# Altium schematic sheet JadePlus_v0.3.1_schematics_PG3_CONN.SchDoc
size A3; SheetNumber: 3; SheetTotal: 3
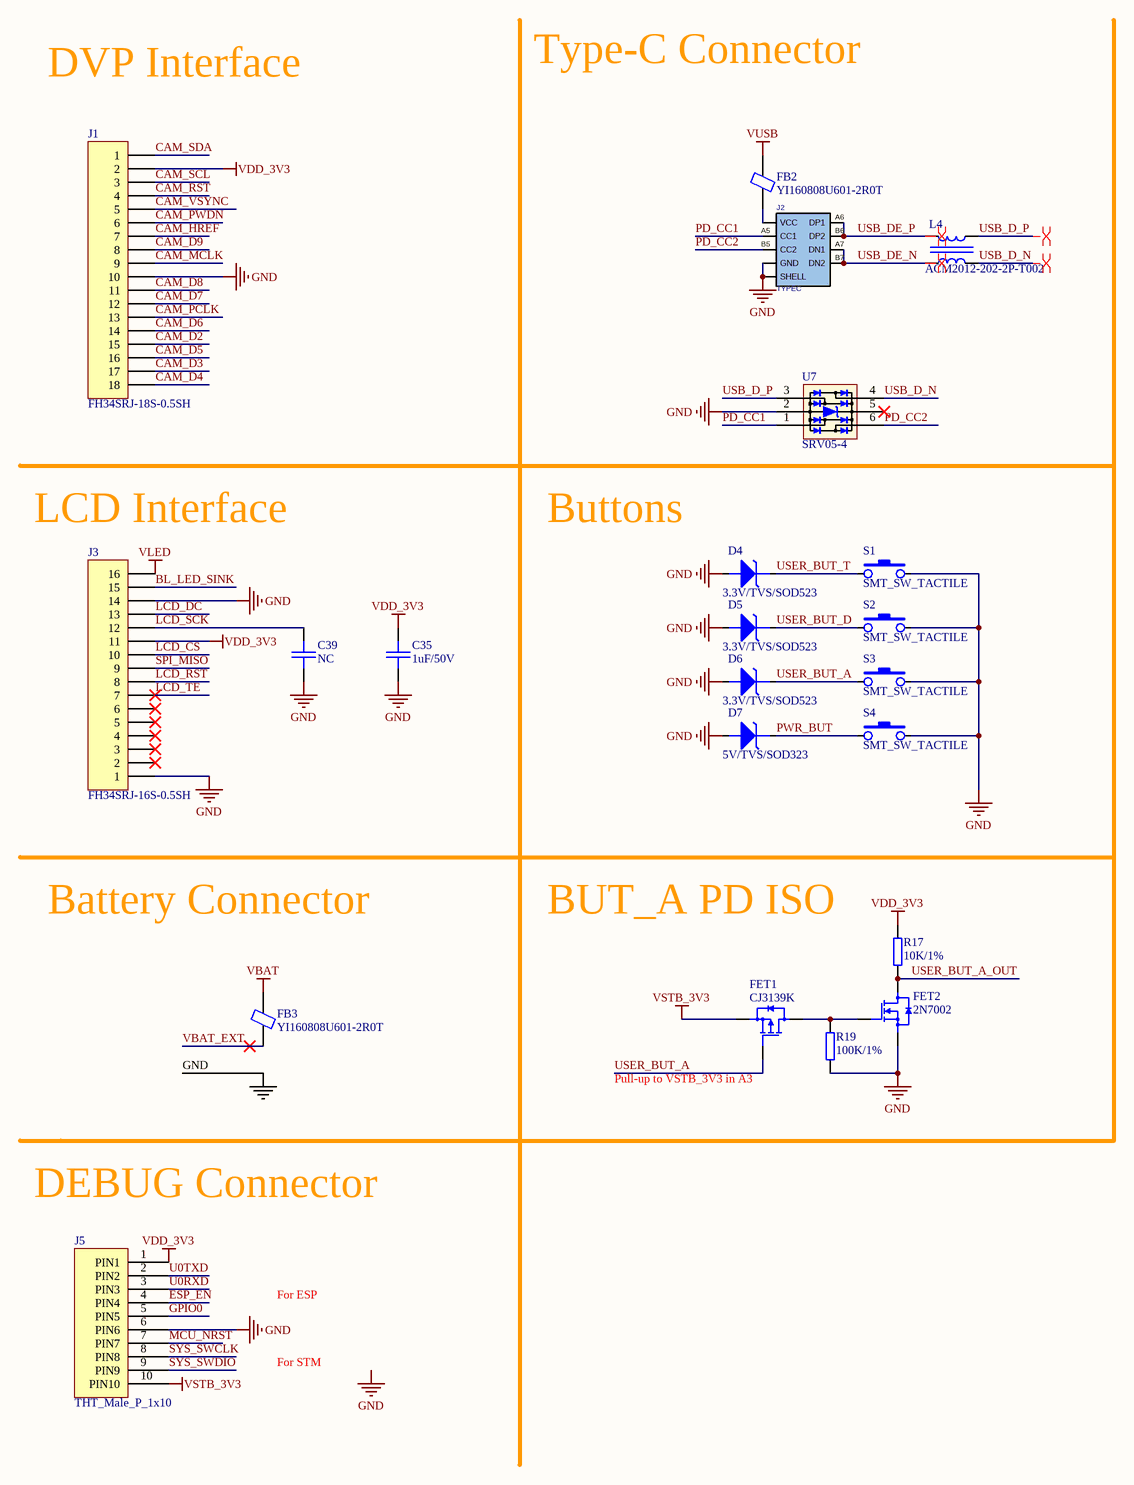
[diagram p0: JadePlus_v0.3.1_schematics_PG3_CONN.SchDoc]

## Parts
C35  1uF/50V  [C0402-L-HD]
C39  NC  [C0201-HD]
D4  3.3V/TVS/SOD523  [SMT_DIODE_SOD_523]
D5  3.3V/TVS/SOD523  [SMT_DIODE_SOD_523]
D6  3.3V/TVS/SOD523  [SMT_DIODE_SOD_523]
D7  5V/TVS/SOD323  [SMT_DIODE_SOD_323]
FB2  YI160808U601-2R0T  [L0603-HD]
FB3  YI160808U601-2R0T  [L0603-HD]
FET1  CJ3139K  [SOT-723-HD]
FET2  2N7002  [SOT-723-HD]
J1  FH34SRJ-18S-0.5SH  [FH34SRJ-18S-0.5SH]
J2  TYPEC  [USB_TYPEC_16P_HD]
J3  FH34SRJ-16S-0.5SH  [FPC_0.5MM_16P_H1.0_DNUP_FH34SRJ-16S-0.5SH]
J5  THT_Male_P_1x10  [THT_Male_P_1x10-2.54mm]
L4  ACM2012-202-2P-T002  [ACM2012]
R17  10K/1%  [R0402-HD]
R19  100K/1%  [R0402-HD]
S1  SMT_SW_TACTILE  [SMT_SW_TS_1186D_C_A]
S2  SMT_SW_TACTILE  [SMT_SW_TS_1186D_C_A]
S3  SMT_SW_TACTILE  [SMT_SW_PTS_820]
S4  SMT_SW_TACTILE  [SMT_SW_TS_1186D_C_A]
U7  SRV05-4  [SOT-236-HD]

## Nets
GND: C35.1 C39.2 D4.1(A) D5.1(A) D6.1(A) D7.1(A) FET2.2(S) J1.10 J2.GND J2.SHELL J3.1 J3.14 J5.6(PIN6) R19.2 S1.2 S2.2 S3.2 S4.2 U7.2
VBAT: FB3.1
VDD_3V3: C35.2 J1.2 J3.11 J5.1(PIN1) R17.1
VLED: J3.16
VSTB_3V3: FET1.2(S) J5.10(PIN10)
VUSB: FB2.1
BL_LED_SINK: J3.15
CAM_D2: J1.15
CAM_D3: J1.17
CAM_D4: J1.18
CAM_D5: J1.16
CAM_D6: J1.14
CAM_D7: J1.12
CAM_D8: J1.11
CAM_D9: J1.8
CAM_HREF: J1.7
CAM_MCLK: J1.9
CAM_PCLK: J1.13
CAM_PWDN: J1.6
CAM_RST: J1.4
CAM_SCL: J1.3
CAM_SDA: J1.1
CAM_VSYNC: J1.5
ESP_EN: J5.4(PIN4)
GPIO0: J5.5(PIN5)
LCD_CS: J3.10
LCD_DC: J3.13
LCD_RST: J3.8
LCD_SCK: C39.1 J3.12
LCD_TE: J3.7
MCU_NRST: J5.7(PIN7)
PD_CC1: J2.A5(CC1) U7.1
PD_CC2: J2.B5(CC2) U7.6
PWR_BUT: D7.2(K) S4.1
SPI_MISO: J3.9
SYS_SWCLK: J5.8(PIN8)
SYS_SWDIO: J5.9(PIN9)
U0RXD: J5.3(PIN3)
U0TXD: J5.2(PIN2)
USB_D_N: L4.3 U7.4
USB_D_P: L4.4 U7.3
USB_DE_N: J2.A7(DN1) J2.B7(DN2) L4.2
USB_DE_P: J2.A6(DP1) J2.B6(DP2) L4.1
USER_BUT_A: D6.2(K) FET1.1(G) S3.1
USER_BUT_A_OUT: FET2.3(D) R17.2
USER_BUT_D: D5.2(K) S2.1
USER_BUT_T: D4.2(K) S1.1
VBAT_EXT: FB3.2
NetFB2_2: FB2.2 J2.VBUS(VCC)
NetFET1_3: FET1.3(D) FET2.1(G) R19.1

Not connected (* = marked no-connect by the designer): J3 2* 3* 4* 5* 6*; U7 5*

## Layout directives
differential pair: USB_D_N, USB_D_P, USB_DE_N, USB_DE_P

## Notes on the sheet
- DVP Interface
- Type-C Connector
- (near J3) LCD Interface
- Buttons
- Battery Connector
- BUT_A PD ISO
- GND
- (near FET1) Pull-up to VSTB_3V3 in A3
- DEBUG Connector
- For ESP
- For STM
- Labels drawn without touching a wire or pin: GND

## Library data of the parts
C35 C39 = SMT_C_0402: Surface mount capacitor 0402
D4-D7 = SMT_DIODE_TVS_U_SOD_523: Surface mount unidirectional TVS diode SOD-523(0603) Package
FB2 FB3 = SMT_FB_0603: Surface mount ferrite beads 0603
FET1 = SI2301-P-Ch-MOSFET: SI2301-P-Ch,-2.3A, -20V.RDS(ON) = 0.190Ω @ VGS = -2.5 V
FET2 = SI2302-N-Ch-MOSFET: SI2302-N-Ch,3A, 20V.RDS(ON) = 0.082Ω @ VGS = 2.5 V
J1 = Header 18: Header, 18-Pin; LatestRevisionDate: 17-Jul-2002; LatestRevisionNote: Re-released for DXP Platform.; Publisher: Altium Limited
J2 = USB_TYPEC_16P
J3 = Header 16: Header, 16-Pin; LatestRevisionDate: 17-Jul-2002; LatestRevisionNote: Re-released for DXP Platform.; Publisher: Altium Limited
J5 = THT_Male_P_1x10: THT Male pin header strip 1x10
L4 = ACM2012
R17 R19 = SMT_R_0402: Surface mount resistor 0402
S1-S4 = SMT_SW_TACTILE: Generic SMT Tactile Switch
U7 = SRV05-4: Low Capacitance(3pF) TVS Diode Array